# EAGLE design RedBoard (EAGLE 7.7.0)
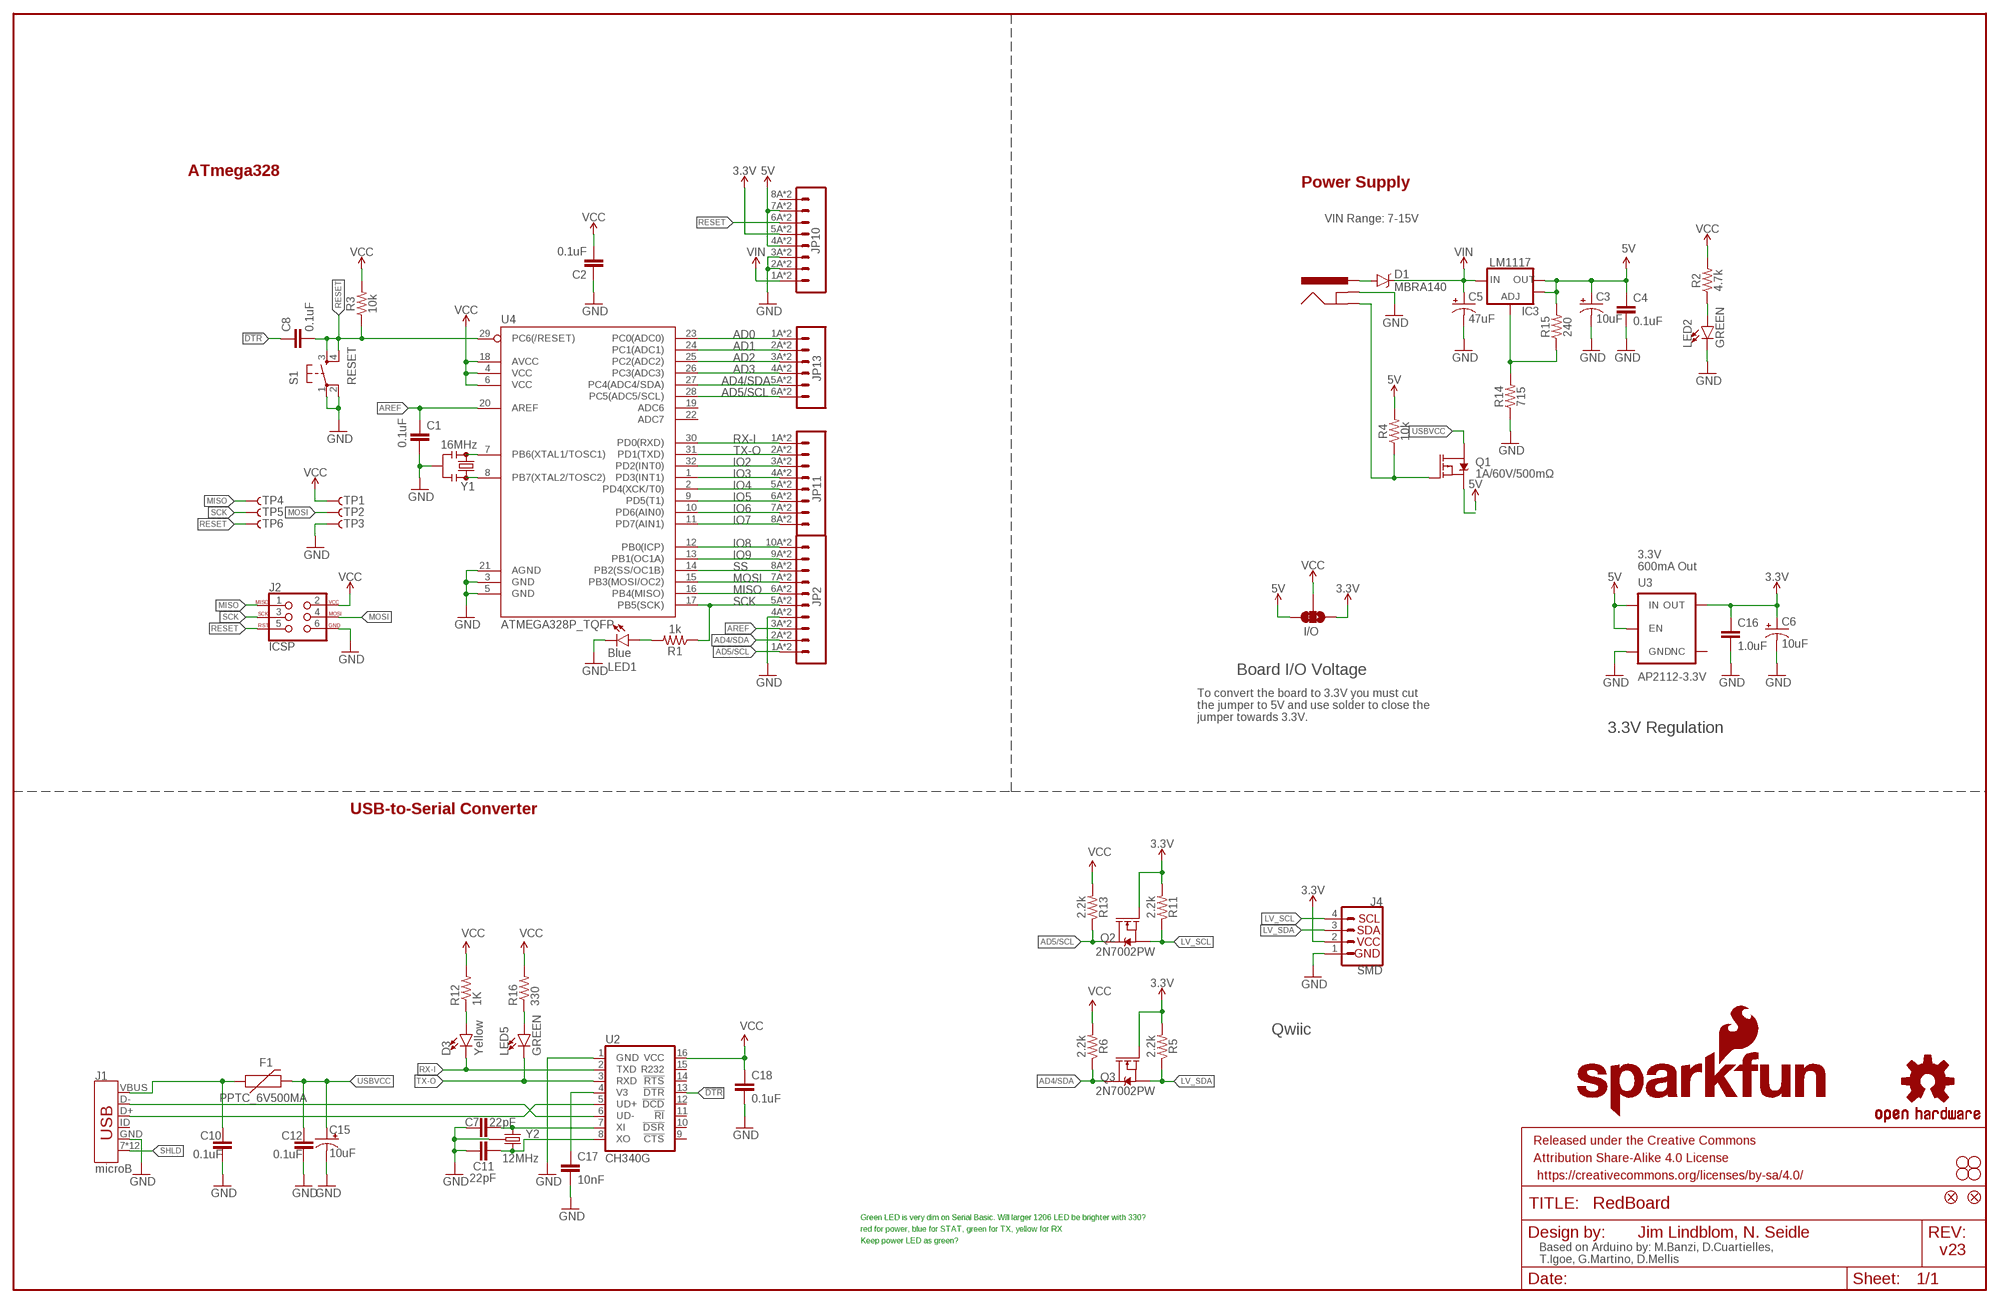
[diagram p0: schematic, sheet 1]

## Parts
C1  0.1uF  0.1UF-0603-25V-(+80/-20%)  [0603]
C2  0.1uF  0.1UF-0603-25V-(+80/-20%)  [0603]
C3  10uF  10UF-POLAR-EIA3216-16V-10%(TANT)  [EIA3216]
C4  0.1uF  0.1UF-0603-25V-(+80/-20%)  [0603]
C5  47uF  47UF-POLAR-PANASONIC_D-35V-20%  [PANASONIC_D]
C6  10uF  10UF-POLAR-EIA3216-16V-10%(TANT)  [EIA3216]
C7  22pF  22PF-0603-50V-5%  [0603]
C8  0.1uF  0.1UF-0603-25V-(+80/-20%)  [0603]
C10  0.1uF  0.1UF-0603-25V-(+80/-20%)  [0603]
C11  22pF  22PF-0603-50V-5%  [0603]
C12  0.1uF  0.1UF-0603-25V-(+80/-20%)  [0603]
C15  10uF  10UF-POLAR-EIA3216-16V-10%(TANT)  [EIA3216]
C16  1.0uF  1.0UF-16V-10%(0603)  [0603-CAP]
C17  10nF  10NF/10000PF-50V-10%(0603)  [0603-CAP]
C18  0.1uF  0.1UF-25V(+80/-20%)(0603)  [0603-CAP]
D1  MBRA140  [SMA-DIODE]
D3  Yellow  LED-YELLOW_HIDDENSILK  [LED-1206-HIDDENSILK]
F1  PPTC_6V500MA  [0805]
FRAME1  FRAME-LEDGER  [CREATIVE_COMMONS]
I/O  JUMPER-SMT_3_1-NC_TRACE_SILK  [SMT-JUMPER_3_1-NC_TRACE_SILK]
IC3  LM1117  V_REG_LM1117ALT1  [SOT223-ALT1]
J1  microB  USB_MICRO-B_HALF_PTH  [USB-MICROB-PTH]
J2  ICSP  AVR_SPI_PROG_3X2SMD  [2X3_SMT_POSTS]
J3  POWER_JACKSUPER_BOMB_DIGITY  [POWER_JACK_SMD_OVERPASTE_SUPER_BOMB_DIGITY]
J4  SMD  I2C_STANDARDJS-1MM  [1X04_1MM_RA]
JP1  SFE_LOGO_NAME.1_INCH  [SFE_LOGO_NAME_.1]
JP2  M10SMD_COMBO  [1X10_SMD_COMBINED]
JP3  STAND-OFF  [STAND-OFF]
JP4  STAND-OFF  [STAND-OFF]
JP5  STAND-OFF  [STAND-OFF]
JP6  STAND-OFF  [STAND-OFF]
JP7  SFE_LOGO_FLAME.1_INCH  [SFE_LOGO_FLAME_.1]
JP8  FIDUCIAL1X2  [FIDUCIAL-1X2]
JP9  FIDUCIAL1X2  [FIDUCIAL-1X2]
JP10  M08SMD-COMBO  [1X08_SMD_COMBINED]
JP11  JP11  M08SMD-COMBO  [1X08_SMD_COMBINED]
JP13  M06SMD-STRAIGHT-COMBO  [1X06_SMD_STRAIGHT_COMBO]
LED1  Blue  LED-BLUE_HIDDENSILK  [LED-1206-HIDDENSILK]
LED2  GREEN  LED-GREEN_HIDDENSILK  [LED-1206-HIDDENSILK]
LED5  GREEN  LED-GREEN_HIDDENSILK  [LED-1206-HIDDENSILK]
Q1  1A/60V/500mΩ  MOSFET-PCH-ZXMP6A13F  [SOT23-3]
Q2  2N7002PW  MOSFET-NCH-2N7002PW  [SOT323]
Q3  2N7002PW  MOSFET-NCH-2N7002PW  [SOT323]
R1  1k  1KOHM-0603-1/10W-1%  [0603]
R2  4.7k  4.7KOHM-0603-1/10W-1%  [0603]
R3  10k  10KOHM-0603-1/10W-1%  [0603]
R4  10k  10KOHM-0603-1/10W-1%  [0603]
R5  2.2k  2.2KOHM-0603-1/10W-1%  [0603]
R6  2.2k  2.2KOHM-0603-1/10W-1%  [0603]
R11  2.2k  2.2KOHM-0603-1/10W-1%  [0603]
R12  1K  1KOHM-1/10W-1%(0603)  [0603-RES]
R13  2.2k  2.2KOHM-0603-1/10W-1%  [0603]
R14  715  715OHM-0603-1/10W-1%  [0603]
R15  240  240OHM-0603-1/10W-1%  [0603]
R16  330  330OHM1/10W1%(0603)  [0603-RES]
S1  RESET  SWITCH_SPST_4_PINSQUARE  [TACTILE-SWITCH-SMD]
TP1  TP-3x5  TEST-POINT3X5  [PAD.03X.05]
TP2  TP-3x5  TEST-POINT3X5  [PAD.03X.05]
TP3  TP-3x5  TEST-POINT3X5  [PAD.03X.05]
TP4  TP-3x5  TEST-POINT3X5  [PAD.03X.05]
TP5  TP-3x5  TEST-POINT3X5  [PAD.03X.05]
TP6  TP-3x5  TEST-POINT3X5  [PAD.03X.05]
U2  CH340G  CH340GSMD  [SO016]
U3  AP2112-3.3V  V_REG_AP2112K-3.3V  [SOT23-5]
U4  ATMEGA328P_TQFP  [TQFP32-08]
U$16  OSHW-LOGOS  [OSHW-LOGO-S]
Y1  16MHz  RESONATOR-16MHZSMD_3.2X1.3  [RESONATOR-SMD-3.2X1.3]
Y2  12MHz  CRYSTAL-GROUNDED3.2X2.5  [CRYSTAL-SMD-3.2X2.5]

## Nets
3.3V: C6.+ C16.1 I/O.1 J4.2(VCC) JP10.5A JP10.5B Q2.1(G) Q3.1(G) R5.2 R11.2 U3.5(OUT)
5V: C3.+ C4.1 I/O.3 IC3.2(OUT) IC3.4(OUT) JP10.4A JP10.4B JP10.7A JP10.7B Q1.2(S) R4.2 R15.2 U3.1(IN) U3.3(EN)
!DTR: C8.1 U2.13(!DTR)
AD0: JP13.1A JP13.1B U4.23(PC0(ADC0))
AD1: JP13.2A JP13.2B U4.24(PC1(ADC1))
AD2: JP13.3A JP13.3B U4.25(PC2(ADC2))
AD3: JP13.4A JP13.4B U4.26(PC3(ADC3))
AD4/SDA: JP2.2A JP2.2B JP13.5A JP13.5B Q3.3(D) R6.1 U4.27(PC4(ADC4/SDA))
AD5/SCL: JP2.1A JP2.1B JP13.6A JP13.6B Q2.3(D) R13.1 U4.28(PC5(ADC5/SCL))
AREF: C1.1 JP2.3A JP2.3B U4.20(AREF)
GND: C1.2 C2.1 C3.- C4.2 C5.- C6.- C7.1 C10.2 C11.1 C12.2 C15.- C16.2 C17.2 C18.2 J1.GND J2.6 J3.GND(GNDBREAK) J4.1(GND) JP2.4A JP2.4B JP10.2A JP10.2B JP10.3A JP10.3B LED1.C LED2.C R14.1 S1.1 S1.2 TP3.P$1 U2.1(GND) U3.2(GND) U4.3(GND) U4.5(GND) U4.21(AGND) Y1.2 Y2.2(GND) Y2.4(GND)
INSERT: J3.P$4(GND) Q1.1(G) R4.1
IO2: JP11.3A JP11.3B U4.32(PD2(INT0))
IO3: JP11.4A JP11.4B U4.1(PD3(INT1))
IO4: JP11.5A JP11.5B U4.2(PD4(XCK/T0))
IO5: JP11.6A JP11.6B U4.9(PD5(T1))
IO6: JP11.7A JP11.7B U4.10(PD6(AIN0))
IO7: JP11.8A JP11.8B U4.11(PD7(AIN1))
IO8: JP2.10A JP2.10B U4.12(PB0(ICP))
IO9: JP2.9A JP2.9B U4.13(PB1(OC1A))
LV_SCL: J4.4(SCL) Q2.2(S) R11.1
LV_SDA: J4.3(SDA) Q3.2(S) R5.1
MISO: J2.1 JP2.6A JP2.6B TP4.P$1 U4.16(PB4(MISO))
MOSI: J2.4 JP2.7A JP2.7B TP2.P$1 U4.15(PB3(MOSI/OC2))
N$1: LED1.A R1.2
N$2: LED2.A R2.1
N$3: U4.7(PB6(XTAL1/TOSC1)) Y1.1
N$4: U4.8(PB7(XTAL2/TOSC2)) Y1.3
N$5: LED5.A R16.1
N$9: D3.A R12.1
N$11: C11.2 U2.8(XO) Y2.3
N$12: C7.2 U2.7(XI) Y2.1
N$13: J1.D- U2.6(UD-)
N$14: J1.D+ U2.5(UD+)
N$15: IC3.1(ADJ) R14.2 R15.1
PWRIN: D1.A J3.VIN0(PWR)
RESET: C8.2 J2.5 JP10.6A JP10.6B R3.1 S1.3 S1.4 TP6.P$1 U4.29(PC6(/RESET))
RX-I: D3.C JP11.1A JP11.1B U2.2(TXD) U4.30(PD0(RXD))
SCK: J2.3 JP2.5A JP2.5B R1.1 TP5.P$1 U4.17(PB5(SCK))
SHLD: J1.7(SHIELD) J1.SHEILD2(SHIELD) J1.SHIELD J1.SHIELD3(SHIELD) J1.SHIELD4(SHIELD) J1.SHIELD5(SHIELD) J1.SHIELD6(SHIELD) J1.SHIELD8(SHIELD) J1.SHIELD9(SHIELD) J1.SHIELD10(SHIELD) J1.SHIELD11(SHIELD) J1.SHIELD12(SHIELD)
SS: JP2.8A JP2.8B U4.14(PB2(SS/OC1B))
TX-O: JP11.2A JP11.2B LED5.C U2.3(RXD) U4.31(PD1(TXD))
USBVCC: C12.1 C15.+ F1.2 Q1.3(D)
V3: C17.1 U2.4(V3)
VCC: C2.2 C18.1 I/O.2 J2.2 R2.2 R3.2 R6.2 R12.2 R13.2 R16.2 TP1.P$1 U2.16(VCC) U4.4(VCC) U4.6(VCC) U4.18(AVCC)
VIN: C5.+ D1.C IC3.3(IN) JP10.1A JP10.1B
VUSB: C10.1 F1.1 J1.VBUS
Unconnected: J1.ID JP10.8A JP10.8B U2.9(!CTS) U2.10(!DSR) U2.11(!RI) U2.12(!DCD) U2.14(!RTS) U2.15(R232) U3.4(NC) U4.19(ADC6) U4.22(ADC7)

## Notes on the sheet
- ATmega328
- Power Supply
- VIN Range: 7-15V
- 3.3V
  600mA Out
- Board I/O Voltage
- To convert the board to 3.3V you must cut
  the jumper to 5V and use solder to close the
  jumper towards 3.3V.
- 3.3V Regulation
- USB-to-Serial Converter
- Qwiic
- Green LED is very dim on Serial Basic. Will larger 1206 LED be brighter with 330?
- red for power, blue for STAT, green for TX, yellow for RX
- Jim Lindblom, N. Seidle
- Keep power LED as green?
- v23
- Based on Arduino by: M.Banzi, D.Cuartielles, 
  T.Igoe, G.Martino, D.Mellis

## Library data of the parts
C1 C2 C4 C8 C10 C12 = SparkFun-Capacitors:0.1UF: 0.1µF ceramic capacitors A capacitor is a passive two-terminal electrical component used to store electrical energy temporarily in an electric field.; PROD_ID: CAP-00810
C3 C6 C15 = SparkFun-Capacitors:10UF-POLAR: 10.0µF polarized capacitors A capacitor is a passive two-terminal electrical component used to store electrical energy temporarily in an electric field.; PROD_ID: CAP-00811
C5 = SparkFun-Capacitors:47UF-POLAR: 47µF polarized capacitors A capacitor is a passive two-terminal electrical component used to store electrical energy temporarily in an electric field.; PROD_ID: CAP-08478
C7 C11 = SparkFun-Capacitors:22PF: 22pF ceramic capacitors A capacitor is a passive two-terminal electrical component used to store electrical energy temporarily in an electric field.; PROD_ID: CAP-07876
C16 = SparkFun-Capacitors:1.0UF-16V-10%(0603): CAP-00868; PROD_ID: CAP-00868
C17 = SparkFun-Capacitors:10NF/10000PF-50V-10%(0603): CAP-00867; PROD_ID: CAP-00867
C18 = SparkFun-Capacitors:0.1UF-25V(+80/-20%)(0603): CAP-00810 Ceramic Standard decoupling cap; PROD_ID: CAP-00810
D1 = SparkFun-DiscreteSemi:MBRA140: 40V, 1A Schottky rectifier SMA/DO-214AC package DIO-08053; PROD_ID: DIO-08053
D3 = SparkFun-LED:LED-YELLOW: Yellow SMD LED Used in manufacturing several products at SparkFun. Packages: 0603 - SMD 0603 package[Product Link] <http://www.kingbrightusa.com/product.asp?catalog_name=LED&product_id=APT1608SYCK> 0603 -SMART - SMART SMD 0603 package (more efficient/more expensive) [Product Link] <http://www.osram-os.com/osram_os/en/products/product-catalog/led-light-emitting-diodes/smartled-0603/ly-l29k/index.jsp> LilyPad - SMD1206 package[Product Datasheet] <https://www.sparkfun.com/datasheets/DevTools/LilyPad/Q150YUS4.pdf> SparkFun Products: Blynk Board <https://www.sparkfun.com/products/13794> IOIO-OTG <https://www.sparkfun.com/products/13613> XBee Explorer Serial <https://www.sparkfun.com/products/13225>; PROD_ID: DIO-09909
F1 = SparkFun-Fuses:PPTC: Resettable Fuse PPTC Resettable Fuse. Really a sort of resistor with a polymeric positive temperature coefficient whose resistance increases dramatically with an increase in temperature. When heated by the power passing through the resistance rises causing the current to be limited, protecting the circuit. This is achieved by the transition of the polymer from a crystalline to an amorphous state where the conductive carbon separates breaking the conductive pathways found in the cool crystalline structure. When a PPTC cools back down it resumes conducting letting the circuit turn back on. SparkFun Products: SparkFun RedBoard - Programmed with Arduino <https://www.sparkfun.com/products/12757> Pro Micro - 5V/16MHz <https://www.sparkfun.com/products/12640> Arduino Pro 328 - 5V/16MHz <https://www.sparkfun.com/products/10915> MP3 Trigger <https://www.sparkfun.com/products/13720>
FRAME1 = SparkFun-Aesthetics:FRAME-LEDGER: Schematic Frame - Ledger Standard 11x14 US Ledger frame
I/O = SparkFun-Jumpers:JUMPER-SMT_3_1-NC_TRACE: Normally closed trace jumper (1 of 2 connections) This jumper has a trace between two pads so it's normally closed (NC). The other connection is normally open (NO). Use a razor knife to open the connection. For best results follow the IPC guidelines for cutting traces: Cutout at least 0.063 mm (0.005 in). Remove all loose material to clean up the cut area. Seal the cut with an approved epoxy. Reapply solder to reclose the connection, or to close the NO connection.
IC3 = Testing:V_REG_LM1117: Voltage Regulator LM1117 Standard adjustable voltage regulator but in SMD form. Spark Fun Electronics SKU : COM-00595; PROD_ID: VREG-08170
J1 = SparkFun-Connectors:USB_MICRO-B: USB Type Micro-B Connector Male/female and PTH/SMT variants SparkFun Products: SparkFun microB USB Breakout <https://www.sparkfun.com/products/12035> SparkFun USB microB Plug Breakout <https://www.sparkfun.com/products/10031> SparkFun ESP8266 Thing <https://www.sparkfun.com/products/13231>; PROD_ID: CONN-13711; VALUE: AMP FCI 10103594-0001LF
J2 = SparkFun-Connectors:AVR_SPI_PROG_3X2: AVR ISP 6 Pin This is the reduced ISP connector for AVR programming. Common on Arduino. This footprint will take up less PCB space and can be used with a 10-pin to 6-pin adapter such as SKU: BOB-08508 **Special note about "TEST_POINT" package. The stop mask is on the top side, so if you want your programming test points to be on the bottom of your board, make sure to place this package on the bottom side of the board. This also ensure that the orientation to program from the bottom side will be correct.; PROD_ID: CONN-11415
J3 = Testing:POWER_JACK: Power Jack This is the standard 5.5mm barrel jack for power. The PTH is the most common, proven, reliable, footprint. All others are experimental. The Slot footprint only works if the mill layer is transmitted to the PCB fab house so be warned. Spark Fun Electronics SKU : PRT-00119. Mating wall wart : TOL-00298 (and others); PROD_ID: CONN-08106
J4 = SparkX:I2C_STANDARD: SparkFun I2C Standard Pinout Header SparkFun has standardized on a pinout for all I2C based sensor breakouts. This pinout allows I2C boards to be plugged directly into the headers on Arduino Uno compatible boards, and to be daisy chained easily. Example SparkFun Products: SparkFun Atmospheric Sensor Breakout - BME280 <https://www.sparkfun.com/products/13676> SparkFun Altitude/Pressure Sensor Breakout - MPL3115A2 <https://www.sparkfun.com/products/11084> SparkFun TOF Range Finder Sensor - VL6180 <https://www.sparkfun.com/products/12785>
JP1 = SparkFun-Aesthetics:SFE_LOGO_NAME: SFE Logo, name only This is the SparkFun name logo. The logo on the schematic will always be the same size; the package variant is the height of the flame part of the logo (or the height the flame would be, if it were drawn). Default layer for the logo on the board is tSilk.
JP2 = SparkFun-Connectors:M10: Header 10 Standard 10-pin 0.1" header. Use with straight break away headers (SKU : PRT-00116), right angle break away headers (PRT-00553), swiss pins (PRT-00743), machine pins (PRT-00117), and female headers (PRT-00115).; PROD_ID: CONN-11219
JP3-JP6 = SparkFun:STAND-OFF: Stand Off This is the mechanical footprint for a #4 phillips button head screw. Use the keepout ring to avoid running the screw head into surrounding components. SKU : PRT-00447
JP7 = SparkFun-Aesthetics:SFE_LOGO_FLAME: SFE Logo, flame only This is the SparkFun flame logo. The logo on the schematic will always be the same size; the package variant is the height of the flame. Default layer for the logo on the board is tSilk.
JP8 JP9 = SparkFun:FIDUCIAL: Fiducial Alignment Points Various fiducial points for machine vision alignment.
JP10 JP11 = SparkFun-Connectors:M08: Header 8 Standard 8-pin 0.1" header. Use with straight break away headers (SKU : PRT-00116), right angle break away headers (PRT-00553), swiss pins (PRT-00743), machine pins (PRT-00117), and female headers (PRT-00115).; PROD_ID: CONN-10204
JP13 = SparkFun-Connectors:M06: Header 6 Standard 6-pin 0.1" header. Use with straight break away headers (SKU : PRT-00116), right angle break away headers (PRT-00553), swiss pins (PRT-00743), machine pins (PRT-00117), and female headers (PRT-00115). Molex polarized connector foot print use with SKU : PRT-08094 with associated crimp pins and housings. NOTES ON THE VARIANTS LOCK and LOCK_LONGPADS... This footprint was designed to help hold the alignment of a through-hole component (i.e. 6-pin header) while soldering it into place. You may notice that each hole has been shifted either up or down by 0.005 of an inch from it's more standard position (which is a perfectly straight line). This slight alteration caused the pins (the squares in the middle) to touch the edges of the holes. Because they are alternating, it causes a "brace" to hold the component in place. 0.005 has proven to be the perfect amount of "off-center" position when using our standard breakaway headers. Although looks a little odd when you look at the bare footprint, once you have a header in there, the alteration is very hard to notice. Also,if you push a header all the way into place, it is covered up entirely on the bottom side. This idea of altering the position of holes to aid alignment will be further integrated into the Sparkfun Library for other footprints. It can help hold any component with 3 or more connection pins.; PROD_ID: CONN-10203
LED1 = SparkFun-LED:LED-BLUE: Blue SMD LED Used in manufacturing of various products at SparkFun Packages: 0603 - SMD 0603 package [Product Link] <http://www.digikey.com/product-detail/en/SMLE12BC7TT86/511-1589-2-ND/1641808> 1206 - SMD1206 package [Product Link] <http://www.digikey.com/product-detail/en/lite-on-inc/LTST-C150TBKT/160-1643-1-ND/573584> SparkFun Products: ESP8266 Thing-Dev Board <https://www.sparkfun.com/products/13711> RedBoard <https://www.sparkfun.com/products/12757>; PROD_ID: DIO-09911
LED2 = SparkFun-LED:LED-GREEN: Green SMD LED Used in manufacturing of various products at SparkFun Packages: 0603 - SMD 0603 package [Product Link] <http://www.futureelectronics.com/en/technologies/semiconductors/optoelectronics/leds/Pages/9894312-LTST-C190GKT.aspx?CrossPart=HSMG-C190&IM=0> LilyPad 1206 - SMD1206 LilyPad package [Product Link] <http://www.futureelectronics.com/en/Technologies/Product.aspx?ProductID=IN150NGHARVATEKCORPORATION2049943&IM=0> 1206 - SMD1206 package [Product Link] <http://www.futureelectronics.com/en/technologies/semiconductors/optoelectronics/leds/Pages/8315665-LTST-C150KGKT.aspx?IM=0> 1206 Bottom Mount -SMD 1206 Bottom Mount [Product Link] <http://www.digikey.com/product-detail/en/lite-on-inc/LTST-C230KGKT/160-1456-1-ND/386854> SparkFun Products: Pro Mini 328 -5V <https://www.sparkfun.com/products/821> RedBoard <https://www.sparkfun.com/products/12757> MP3 Trigger <https://www.sparkfun.com/products/13720> Makey Makey <https://www.sparkfun.com/products/11076>; PROD_ID: DIO-09910
LED5 = SparkFun-LED:LED-GREEN: Green SMD LED Used in manufacturing of various products at SparkFun Packages: 0603 - SMD 0603 package [Product Link] <http://www.futureelectronics.com/en/technologies/semiconductors/optoelectronics/leds/Pages/9894312-LTST-C190GKT.aspx?CrossPart=HSMG-C190&IM=0> LilyPad 1206 - SMD1206 LilyPad package [Product Link] <http://www.futureelectronics.com/en/Technologies/Product.aspx?ProductID=IN150NGHARVATEKCORPORATION2049943&IM=0> 1206 - SMD1206 package [Product Link] <http://www.futureelectronics.com/en/technologies/semiconductors/optoelectronics/leds/Pages/8315665-LTST-C150KGKT.aspx?IM=0> 1206 Bottom Mount -SMD 1206 Bottom Mount [Product Link] <http://www.digikey.com/product-detail/en/lite-on-inc/LTST-C230KGKT/160-1456-1-ND/386854> SparkFun Products: Pro Mini 328 -5V <https://www.sparkfun.com/products/821> RedBoard <https://www.sparkfun.com/products/12757> MP3 Trigger <https://www.sparkfun.com/products/13720> Makey Makey <https://www.sparkfun.com/products/11076>; PROD_ID: DIO-00862
Q1 = SparkFun-DiscreteSemi:MOSFET-PCH: P-channel MOSFETs Voltage controlled devices that allow control of high current outputs.; PROD_ID: TRANS-08285
Q2 Q3 = SparkFun-DiscreteSemi:MOSFET-NCH: N-channel MOSFETs Voltage controlled devices that allow control of high current outputs.; PROD_ID: TRANS-11151; VALUE: 310mA/60V/1.6Ω
R1 = SparkFun-Resistors:1KOHM: 1kΩ resistor A resistor is a passive two-terminal electrical component that implements electrical resistance as a circuit element. Resistors act to reduce current flow, and, at the same time, act to lower voltage levels within circuits.; PROD_ID: RES-07856
R2 = SparkFun-Resistors:4.7KOHM: 4.7kΩ resistor A resistor is a passive two-terminal electrical component that implements electrical resistance as a circuit element. Resistors act to reduce current flow, and, at the same time, act to lower voltage levels within circuits.; PROD_ID: RES-07857
R3 R4 = SparkFun-Resistors:10KOHM: 10kΩ resistor A resistor is a passive two-terminal electrical component that implements electrical resistance as a circuit element. Resistors act to reduce current flow, and, at the same time, act to lower voltage levels within circuits.; PROD_ID: RES-00824
R5 R6 R11 R13 = SparkFun-Resistors:2.2KOHM: 2.2kΩ resistor A resistor is a passive two-terminal electrical component that implements electrical resistance as a circuit element. Resistors act to reduce current flow, and, at the same time, act to lower voltage levels within circuits. - Wikipedia; PROD_ID: RES-08272
R12 = SparkFun-Resistors:1KOHM-1/10W-1%(0603): RES-07856; PROD_ID: RES-07856
R14 = SparkFun-Resistors:715OHM: 715Ω resistor A resistor is a passive two-terminal electrical component that implements electrical resistance as a circuit element. Resistors act to reduce current flow, and, at the same time, act to lower voltage levels within circuits.; PROD_ID: RES-07850
R15 = SparkFun-Resistors:240OHM: 240Ω resistor A resistor is a passive two-terminal electrical component that implements electrical resistance as a circuit element. Resistors act to reduce current flow, and, at the same time, act to lower voltage levels within circuits.; PROD_ID: RES-07849
R16 = SparkFun-Resistors:330OHM1/10W1%(0603): RES-00818; PROD_ID: RES-00818
S1 = SparkFun-Electromechanical:SWITCH_SPST_4_PIN; PROD_ID: SWCH-08247
TP1-TP4 TP6 = SparkFun-Connectors:TEST-POINT: Bare copper test points for troubleshooting or ICT
TP5 = SparkFun-Passives:TEST-POINT: Bare copper test points for troubleshooting or ICT
U2 = SparkFun-DigitalIC:CH340G: A simple USB 2.0 to Serial IC.; PROD_ID: IC-13498
U3 = SparkFun-PowerIC:V_REG_AP2112: AP2112 - 600mA CMOS LDO Regulator w/ Enable The AP2112 is CMOS process low dropout linear regulator with enable function, the regulator delivers a guaranteed 600mA (min.) continuous load current. Features Output Voltage Accuracy: ±1.5% Output Current: 600mA (Min.) Foldback Short Current Protection: 50mA Enable Function to Turn ON/OFF VOUT Low Dropout Voltage (3.3V): 250mV (Typ.) @IOUT=600mA Excellent Load Regulation: 0.2%/A (Typ.) Excellent Line Regulation: 0.02%/V (Typ.) Low Quiescent Current: 55μA (Typ.) Low Standby Current: 0.01μA (Typ.) Low Output Noise: 50μVRMS PSRR: 100Hz -65dB, 1kHz -65dB OTSD Protection Stable with 1.0μF Flexible Cap: Ceramic, Tantalum and Aluminum Electrolytic Operation Temperature Range: -40°C to 85°C ESD: MM 400V, HBM 4000V; PROD_ID: VREG-12457; VALUE: 3.3V
U4 = SparkFun-IC-Microcontroller:ATMEGA328P_TQFP; PROD_ID: IC-09069
U$16 = SparkFun-Aesthetics:OSHW-LOGO: Open Source Hardware Logo This logo indicates the piece of hardware it is found on incorporates a OSHW license and/or adheres to the definition of open source hardware found here: http://freedomdefined.org/OSHW
Y1 = SparkFun-Clocks:RESONATOR-16MHZ: 16MHz Resonator Digikey Example <http://www.digikey.com/product-detail/en/murata-electronics-north-america/CSTCE16M0V53-R0/490-1198-1-ND/584635> Frequency: 16MHz Frequency Stability: ±0.3% Frequency Tolerance: ±0.5% Capacitance: 15pF; PROD_ID: XTAL-08900
Y2 = USB Basic:CRYSTAL-GROUNDED: Small, 3.2x2.5mm, SMD Crystal; PROD_ID: XTAL-13518

## Net classes
1 power: width 0.178 mm

## Board
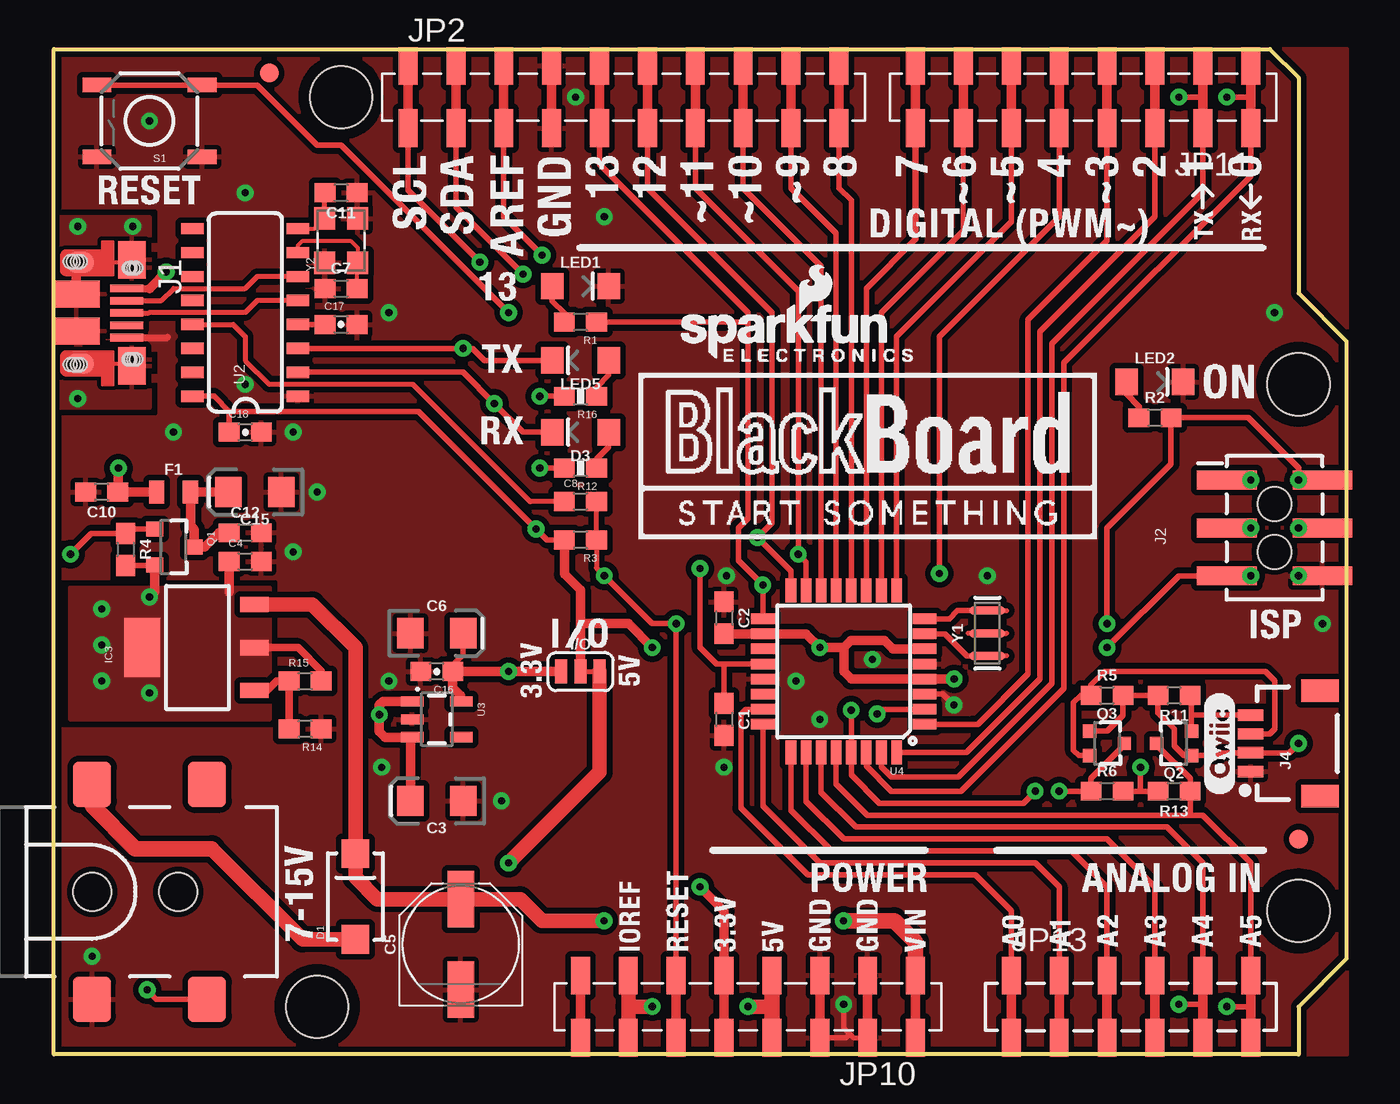
[diagram p1: board, top side]
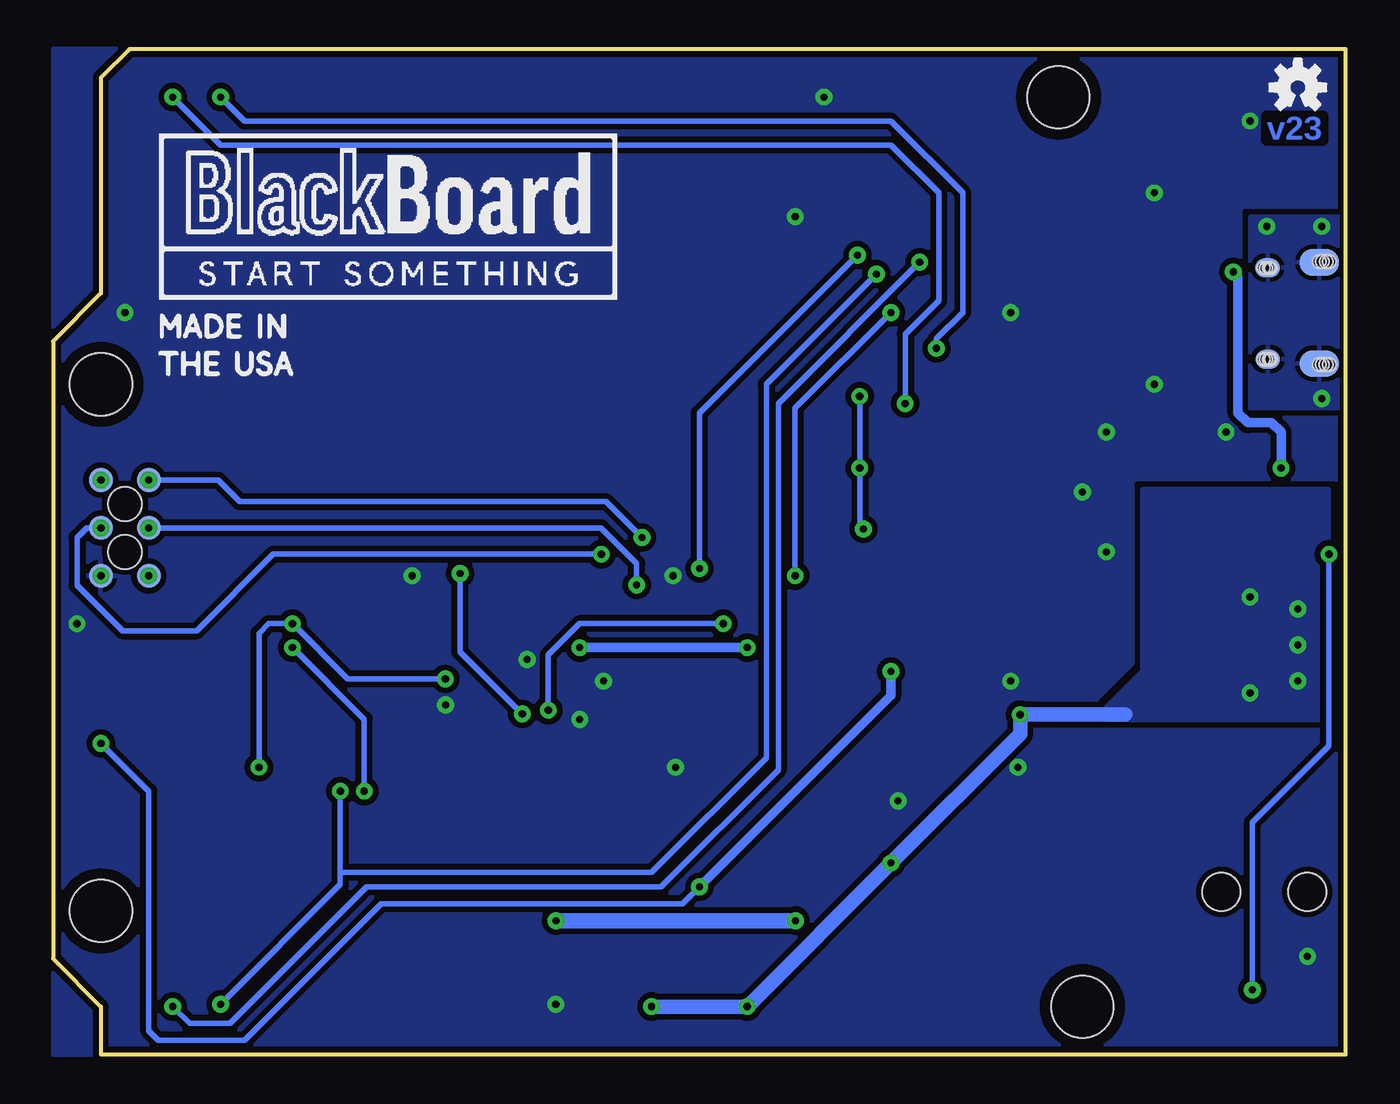
[diagram p2: board, bottom side, seen from below]

Size 68.58 x 53.34 mm. Coordinates in mm from the lower left corner, seen from the top.
Outline: 0,53.34 64.52,53.34 66.04,51.82 66.04,40.39 68.58,37.85 68.58,5.08 66.04,2.54 66.04,0 0,0 0,53.34
Copper layers (1*16): Top 0.035mm / dielectric 1.5mm / Bottom 0.035mm
Design rules "SparkFun-2-layer": minimum track width 7mil, minimum drill 15mil, track to track 8mil, track to pad 8mil, pad to pad 8mil, via to via 8mil, smd to smd 8mil, copper to edge 8mil, drill to drill 8mil, minimum pad ring 12mil, minimum via ring 10mil, stop-mask expansion 4mil, vias tented up to drill 20mil, thermal gap 10mil
vRestrict: area 0.6,22.4 to 2,30.6; area 5.7,23.1 to 7.4,30.6; area 47.9,10.8 to 48.5,11.3; area 50.4,10.7 to 50.9,11.6; area 11.3,29.3 to 12.7,31.6; area 0.3,13 to 9.4,25

### Footprints (pad centres in the part's own frame; a part is rotated, then mirrored left to right if it is on the bottom)
0603 = smd 1.1 x 1: 1 -0.85,0; 2 0.85,0
EIA3216 = smd 1.4 x 1.6: + 1.4,0; - -1.4,0
PANASONIC_D = smd 3 x 1.4: + 2.4,0; - -2.4,0
0603-CAP = smd 1.1 x 1: 1 -0.85,0; 2 0.85,0
SMA-DIODE = smd 1.524 x 1.47: A -2.277,0; C 2.277,0
LED-1206-HIDDENSILK = smd 1.2 x 1.4: A -1.5,0; C 1.5,0
0805 = smd 0.8 x 1.2: 1 -0.9,0; 2 0.9,0
SMT-JUMPER_3_1-NC_TRACE_SILK = smd 0.635 x 1.27: 1 -1.016,0; 2 0,0; 3 1.016,0
SOT223-ALT1 = smd 0.813 x 1.524: 1 -2.271,-3.02; 2 0,-3.02; 3 2.288,-3.02 | smd 3.124 x 1.905: 4 0,2.921
USB-MICROB-PTH = smd 1.4 x 2.1 bottom: 7 2.701,-1.142; SHIELD5 -2.659,-1.144 | smd 0.4 x 1.75: D+ 0.031,1.331; D- -0.619,1.331; GND 1.331,1.331; ID 0.681,1.331; VBUS -1.269,1.331 | smd 2 x 1.46: SHEILD2 2.831,1.606; SHIELD -2.794,1.606 | smd 1.425 x 2.5: SHIELD3 -0.979,-1.349; SHIELD4 0.996,-1.352 | smd 1.1 x 1.5: SHIELD6 2.701,-1.142; SHIELD8 -2.659,-1.144 | smd 1 x 1.3 bottom: SHIELD9 -2.368,1.604; SHIELD12 2.481,1.598 | smd 1 x 1.3: SHIELD10 -2.368,1.604; SHIELD11 2.487,1.594 | hole 0.7: -2.693,-1.134; -2.693,-1.3; -2.694,-1.499; -2.694,-1.664; 2.768,-1.134; 2.767,-1.303; 2.766,-1.496; 2.766,-1.664 | hole 0.66: -2.359,1.821; -2.349,1.691; -2.359,1.541; -2.354,1.432; 2.481,1.821; 2.491,1.691; 2.481,1.541; 2.486,1.432
2X3_SMT_POSTS = smd 1 x 3.17: 1 -2.54,-2.54; 2 -2.54,2.54; 3 0,-2.54; 4 0,2.54; 5 2.54,-2.54; 6 2.54,2.54 | hole 1.8: -1.27,0; 1.27,0
POWER_JACK_SMD_OVERPASTE_SUPER_BOMB_DIGITY = smd 2 x 2.4: GND 0,-5.7; P$4 6.1,-5.7; VIN0 0,5.7; VIN1 6.1,5.7 | hole 2.032: 0,0; 4.572,0
1X04_1MM_RA = smd 0.6 x 1.35: 1 -1.5,0; 2 -0.5,0; 3 0.5,0; 4 1.5,0 | smd 1.2 x 2: NC1 2.8,-3.675; NC2 -2.8,-3.675
1X10_SMD_COMBINED = smd 1 x 2: 1A 0,1.65; 1B 0,-1.65; 2A 2.54,1.65; 2B 2.54,-1.65; 3A 5.08,1.65; 3B 5.08,-1.65; 4A 7.62,1.65; 4B 7.62,-1.65; 5A 10.16,1.65; 5B 10.16,-1.65; 6A 12.7,1.65; 6B 12.7,-1.65; 7A 15.24,1.65; 7B 15.24,-1.65; 8A 17.78,1.65; 8B 17.78,-1.65; 9A 20.32,1.65; 9B 20.32,-1.65; 10A 22.86,1.65; 10B 22.86,-1.65
STAND-OFF = hole 3.302: 0,0
FIDUCIAL-1X2 = smd 1 x 1: 1 0,0
1X08_SMD_COMBINED = smd 1 x 2: 1A 0,1.65; 1B 0,-1.65; 2A 2.54,-1.65; 2B 2.54,1.65; 3A 5.08,1.65; 3B 5.08,-1.65; 4A 7.62,-1.65; 4B 7.62,1.65; 5A 10.16,1.65; 5B 10.16,-1.65; 6A 12.7,-1.65; 6B 12.7,1.65; 7A 15.24,1.65; 7B 15.24,-1.65; 8A 17.78,-1.65; 8B 17.78,1.65
1X06_SMD_STRAIGHT_COMBO = smd 1 x 2: 1A 0,-1.65; 1B 0,1.65; 2A 2.54,1.65; 2B 2.54,-1.65; 3A 5.08,-1.65; 3B 5.08,1.65; 4A 7.62,1.65; 4B 7.62,-1.65; 5A 10.16,-1.65; 5B 10.16,1.65; 6A 12.7,1.65; 6B 12.7,-1.65
SOT23-3 = smd 0.8 x 0.9: 1 -0.95,-1; 2 0.95,-1; 3 0,1.1
SOT323 = smd 0.7 x 0.7: 1 -0.65,-0.925; 2 0.65,-0.925; 3 0,0.925
0603-RES = smd 1.1 x 1: 1 -0.85,0; 2 0.85,0
TACTILE-SWITCH-SMD = smd 1.524 x 0.762: 1 -2.794,1.905; 2 2.794,1.905; 3 -2.794,-1.905; 4 2.794,-1.905
PAD.03X.05 = smd 1.27 x 1.27: P$1 0,0
SO016 = smd 0.6 x 1.2: 1 -4.445,-2.8; 2 -3.175,-2.8; 3 -1.905,-2.8; 4 -0.635,-2.8; 5 0.635,-2.8; 6 1.905,-2.8; 7 3.175,-2.8; 8 4.445,-2.8; 9 4.445,2.8; 10 3.175,2.8; 11 1.905,2.8; 12 0.635,2.8; 13 -0.635,2.8; 14 -1.905,2.8; 15 -3.175,2.8; 16 -4.445,2.8
SOT23-5 = smd 0.55 x 1.2: 1 -0.95,-1.3; 2 0,-1.3; 3 0.95,-1.3; 4 0.95,1.3; 5 -0.95,1.3
TQFP32-08 = smd 1.27 x 0.559: 1 -4.293,2.8; 2 -4.293,2; 3 -4.293,1.2; 4 -4.293,0.4; 5 -4.293,-0.4; 6 -4.293,-1.2; 7 -4.293,-2; 8 -4.293,-2.8; 17 4.293,-2.8; 18 4.293,-2; 19 4.293,-1.2; 20 4.293,-0.4; 21 4.293,0.4; 22 4.293,1.2; 23 4.293,2; 24 4.293,2.8 | smd 0.559 x 1.27: 9 -2.8,-4.293; 10 -2,-4.293; 11 -1.2,-4.293; 12 -0.4,-4.293; 13 0.4,-4.293; 14 1.2,-4.293; 15 2,-4.293; 16 2.8,-4.293; 25 2.8,4.293; 26 2,4.293; 27 1.2,4.293; 28 0.4,4.293; 29 -0.4,4.293; 30 -1.2,4.293; 31 -2,4.293; 32 -2.8,4.293
RESONATOR-SMD-3.2X1.3 = smd 0.45 x 1.905: 1 -1.2,0; 2 0,0; 3 1.2,0
CRYSTAL-SMD-3.2X2.5 = smd 1.2 x 1.1: 1 -1.175,-0.875; 2 1.175,-0.875; 3 1.175,0.875; 4 -1.175,0.875

### Placement (x,y rotation side)
C1  35.56,17.78 270 top
C2  35.56,23.17 270 top
C3  20.32,13.46 180 top
C4  10.16,26.16 0 top
C5  21.59,5.84 90 top
C6  20.32,22.35 0 top
C7  15.24,40.64 0 top
C8  27.94,29.34 0 top
C10  2.54,29.84 180 top
C11  15.24,45.72 180 top
C12  10.16,27.69 0 top
C15  10.67,29.84 180 top
C16  20.32,20.32 180 top
C17  15.24,38.73 0 top
C18  10.16,33.02 0 top
D1  16,8.38 90 top
D3  27.94,33.02 180 top
F1  6.35,29.84 0 top
FRAME1  -1.27,-35.56 0 top  (outside the outline)
I/O  27.94,20.32 0 top
IC3  7.62,21.59 90 top
J1  2.54,39.37 270 top
J2  64.77,27.94 270 top
J3  2.03,8.64 0 top
J4  63.5,16.51 90 top
JP1  32.79,36.45 0 top
JP2  18.8,50.8 0 top
JP3  13.97,2.54 0 top
JP4  66.04,7.62 0 top
JP5  66.04,35.56 0 top
JP6  15.24,50.8 0 top
JP7  39.27,38.99 0 top
JP8  66.04,11.43 0 top
JP9  11.43,52.07 0 top
JP10  45.72,2.54 180 top
JP11  63.5,50.8 180 top
JP13  50.8,2.54 0 top
LED1  27.94,40.77 0 top
LED2  58.42,35.69 0 top
LED5  27.94,36.83 180 top
Q1  6.35,26.92 270 top
Q2  59.44,16.51 90 top
Q3  55.88,16.51 270 top
R1  27.94,38.86 180 top
R2  58.42,33.78 0 top
R3  27.94,27.3 180 top
R4  3.81,26.8 270 top
R5  55.88,19.05 0 top
R6  55.88,13.97 0 top
R11  59.44,19.05 180 top
R12  27.94,31.11 180 top
R13  59.44,13.97 180 top
R14  13.34,17.27 180 top
R15  13.34,19.81 0 top
R16  27.94,34.92 180 top
S1  5.08,49.53 180 top
TP1  66.04,30.48 0 bottom
TP2  66.04,27.94 0 bottom
TP3  66.04,25.4 0 bottom
TP4  63.5,30.48 0 bottom
TP5  63.5,27.94 0 bottom
TP6  63.5,25.4 0 bottom
U2  10.16,39.37 90 top
U3  20.32,17.78 270 top
U4  41.91,20.32 180 top
U$1  [BLACKBOARDLOGO#PNG]  43.18,31.75 0 top
U$2  [(QWIIC)]  61.85,13.72 90 top
U$3  [BLACKBOARDLOGO#PNG]  50.8,44.45 0 bottom
U$4  [MADEINUSA#PNG]  59.44,37.59 0 bottom
U$16  2.54,51.31 0 bottom
Y1  49.53,22.35 90 top
Y2  15.24,43.18 90 top

### Tracks (layer width: path | path; a pad name or v marks a point on that pad's centre or on a via)
3.3V  (via drill 0.38)
  Top 0.305: C6.+ 21.72,21.21 21.17,20.66 C16.1 | Q3.1 55.9,17.16 56.73,18 R5.2 R11.2 58.59,18.12 59.44,17.27 59.44,16.38 59.96,15.86 Q2.1 61.83,15.86 61.98,16.01 J4.2 65.54,16.01 v66.04,16.51
  Top 0.508: JP10.5A 35.56,7.62 v34.29,8.89 | I/O.1 v24.13,20.32 C16.1 21.17,19.47 21.59,19.05 21.59,18.76 U3.5
  Bottom 0.305: v34.29,8.89 35.18,8 51.18,8 58.42,0.76 62.99,0.76 63.5,1.27 63.5,13.97 v66.04,16.51
  Bottom 0.508: v24.13,20.32 24.13,19.05 v34.29,8.89
5V  (via drill 0.38)
  Top 0.305: JP10.4A 38.1,2.03 | R4.2 5.32,25.95 Q1.2
  Top 0.406: IC3.2 12.95,21.59 14.19,20.36 R15.2 | C3.+ 19.05,13.46
  Top 0.508: C3.+ 18.92,16.73 U3.3 17.59,16.83 17.27,17.14 v17.27,18.03 17.27,18.54 17.46,18.73 U3.1 | Q1.2 5.35,24.54 v5.08,24.27 | C4.1 9.31,24.55
  Top 0.762: v36.83,2.54 37.85,2.54 38.1,2.79 | v31.75,2.54 30.48,2.54 | 30.48,2.54 JP10.7A | JP10.7B 30.48,2.54 | I/O.3 28.96,14.99 v24.13,10.16
  Top 0.813: JP10.4A 38.1,2.79 38.1,2.03 JP10.4B
  Bottom 0.762: v36.83,2.54 v31.75,2.54 v24.13,10.16 17.27,17.02 v17.27,18.03 | v17.27,18.03 11.68,18.03 | 16.51,18.03 v17.27,18.03
  other vias: 2.54,21.73 5.08,19.19 2.54,19.82 2.54,23.63
  pour Bottom (isolate 0.305, no thermals): 0.89,29.97 10.79,29.97 10.79,20.32 12.7,18.41 12.7,17.78 0.89,17.78
  pour Top (isolate 0.305, no thermals): 0.89,17.78 0.89,24.77 11.43,24.77 11.43,17.78
!DTR
  Top 0.254: U2.13 9.53,38.73 10.16,38.1 10.16,36.83 11.43,35.56 19.05,35.56 25.27,29.34 C8.1
AD0
  Top 0.305: JP13.1A 50.8,7.62 48.9,9.53 40.01,9.53 36.45,13.08 36.45,18.03 36.73,18.32 U4.23
AD1
  Top 0.305: U4.24 37.62,13.18 40.64,10.16 52.07,10.16 53.34,8.89 JP13.2A
AD2
  Top 0.305: U4.25 39.11,12.96 41.27,10.79 53.98,10.79 55.88,8.89 JP13.3A
AD3
  Top 0.305: U4.26 39.91,13.43 41.91,11.43 55.88,11.43 58.42,8.89 JP13.4A
AD4/SDA  (via drill 0.38)
  Top 0.305: U4.27 40.71,13.9 42.55,12.06 59.05,12.06 60.96,10.16 60.96,2.67 | 60.96,2.67 JP13.5A | JP2.2B 21.34,44.96 v24.89,41.4 | v59.69,2.67 60.96,2.67 | Q3.3 56.8,16.42 55.03,14.64 R6.1 v53.34,13.97
  Bottom 0.305: 53.34,9.65 36.83,9.65 30.73,15.75 30.73,35.56 v24.89,41.4 | v59.69,2.67 53.34,9.02 53.34,9.65 | v53.34,13.97 53.34,9.65
AD5/SCL  (via drill 0.38)
  Top 0.305: U4.28 41.51,14.37 43.18,12.7 60.2,12.7 | 60.2,12.7 60.96,12.7 63.5,10.16 JP13.6A 63.5,2.54 v62.23,2.54 | JP2.1B 18.8,45.85 v22.61,42.04 | Q2.3 58.59,16.43 58.59,16.34 60.29,14.64 R13.1 60.29,12.79 60.2,12.7
  Bottom 0.305: v22.61,42.04 30.1,34.54 30.1,15.11 36.32,8.89 51.94,8.89 59.18,1.65 61.34,1.65 v62.23,2.54
AREF  (via drill 0.38)
  Top 0.305: 35.56,20.72 35.16,20.72 34.29,21.59 v34.29,25.78 | 35.56,20.72 U4.20 | C1.1 35.56,20.72 | JP2.3B 23.88,44.45 v25.91,42.42
  Bottom 0.305: v25.91,42.42 34.29,34.04 v34.29,25.78
GND  (via drill 0.38, 0.38 pad 0.51)
  Top 0.254: JP10.2B 42.42,0.89 42.23,1.08 41.91,1.4 v41.91,2.67
  Top 0.305: U4.3 47.17,19.12 v47.75,18.54 | JP10.3A 42.04,0.89 42.23,1.08
  Top 0.381: J1.GND 6.04,38.04
  other vias: 5.08,49.53 64.77,39.37 40.64,17.78 27.69,50.8 43.43,20.95 49.53,25.4 35.69,25.4 2.03,5.21 29.21,44.45 67.31,22.86 17.78,19.81 17.4,15.24 66.04,25.4 6.35,33.02 13.97,29.84 12.7,33.02 12.7,26.67 10.16,35.56 10.16,45.72 17.78,39.37 23.75,13.46 35.56,15.24 39.37,19.81
  pour Top (isolate 0.305, rank 2): 0,53.34 68.58,53.34 68.58,0 0,0
  pour Bottom (isolate 0.305, rank 2): 0,53.34 68.58,53.34 68.58,0 0,0
INSERT  (via drill 0.38)
  Top 0.305: J3.P$4 5.45,2.94 v4.95,3.43 | Q1.1 4.04,27.87 R4.1 1.99,27.65 v0.89,26.54
  Bottom 0.305: v4.95,3.43 4.95,12.32 0.89,16.38 v0.89,26.54
IO2
  Top 0.305: JP11.3A 58.42,44.45 52.32,38.35 52.32,19.94 48.41,16.03 U4.32
IO3
  Top 0.305: JP11.4A 55.88,43.18 51.69,38.99 51.69,20.19 49.02,17.53 48.77,17.53 48.76,17.52 U4.1
IO4  (via drill 0.38)
  Top 0.305: v46.99,25.53 46.99,38.1 53.34,44.45 JP11.5A | U4.2 43.94,18.32 v43.69,18.07
  Bottom 0.305: v43.69,18.07 46.99,21.37 v46.99,25.53
IO5
  Top 0.305: U4.9 44.71,38.1 50.8,44.19 JP11.6A
IO6
  Top 0.254: 48.26,43.72 JP11.7A
  Top 0.305: U4.10 43.91,39.37 48.26,43.72
IO7
  Top 0.305: U4.11 43.11,40.64 45.72,43.25
  Top 0.356: 45.72,43.25 JP11.8A
IO8
  Top 0.305: U4.12 42.31,45.32 41.66,45.97 JP2.10B
IO9
  Top 0.305: U4.13 41.51,43.58 39.12,45.97 JP2.9B
LV_SCL
  Top 0.305: Q2.2 60.36,18.03 | 60.36,18.03 60.36,18.98 R11.1 | J4.4 60.38,18.01 60.36,18.03
LV_SDA
  Top 0.305: J4.3 64.51,17.01 64.77,17.27 64.77,19.81 64.26,20.32 55.75,20.32 55.03,19.6 R5.1 54.48,19.05 54.1,18.67 54.1,16.13 54.37,15.86 Q3.2
MISO  (via drill 0.38, 0.38 pad 0.51)
  Top 0.305: U4.16 39.11,25.66 v37.34,27.43 38.1,28.19 38.1,39.37 31.5,45.97 JP2.6B | J2.1 TP4.P$1
  Bottom 0.305: v37.34,27.43 39.24,29.34 58.67,29.34 59.82,30.48 TP4.P$1
  other vias: 63.5,30.48
MOSI  (via drill 0.38, 0.38 pad 0.51)
  Top 0.305: U4.15 39.91,26.13 v39.5,26.54 39.5,40.51 34.04,45.97 JP2.7B | J2.4 TP2.P$1
  Bottom 0.305: v39.5,26.54 56.9,26.54 60.96,22.48 64.9,22.48 67.31,24.89 67.31,27.43 66.8,27.94 TP2.P$1
  other vias: 66.04,27.94
N$1
  Top 0.305: R1.2 27.09,39.33 26.44,39.98 LED1.A
N$2
  Top 0.356: R2.1 57.57,34.38 56.92,35.03 LED2.A
N$3
  Top 0.305: U4.7 47.28,22.32 48.44,21.15 Y1.1
N$4
  Top 0.305: U4.8 47.5,23.12 47.94,23.55 Y1.3
N$5
  Top 0.305: R16.1 28.79,35.39 29.44,36.04 LED5.A
N$9
  Top 0.305: R12.1 28.79,31.58 29.44,32.23 D3.A
N$11
  Top 0.203: U2.8 13.82,43.81 Y2.3
  Top 0.254: Y2.3 14.37,45.7 C11.2
N$12
  Top 0.203: U2.7 12.96,42.93 13.21,43.18 15.75,43.18 16.13,42.8 Y2.1 16.09,41.98 C7.2
N$13
  Top 0.254: J1.D- 5.7,39.99 6.35,40.64 10.16,40.64 10.79,41.27 U2.6
N$14
  Top 0.254: U2.5 10.79,40.01 10.16,39.37 5.08,39.37 5.05,39.34 J1.D+
N$15
  Top 0.406: IC3.1 11.32,19.32 11.81,19.81 R15.1 R14.2
PWRIN
  Top 0.762: 8.38,10.92 13.2,6.11 D1.A
  Top 0.813: 8.38,10.92 4.32,10.92 2.03,13.21 J3.VIN0
RESET  (via drill 0.38, 0.38 pad 0.51)
  Top 0.254: C8.2 R3.1 28.79,25.82 v29.21,25.4
  Top 0.305: v42.31,18.27 U4.29 42.31,14.84 43.81,13.34 51.44,13.34 v52.07,13.97 | JP10.6B JP10.6A v33.02,22.86 31.75,22.86 v29.21,25.4 | TP6.P$1 J2.5 59.69,25.4 v55.88,21.59 | S1.4 S1.3 10.79,51.44 13.97,48.26 15.24,48.26 v24.13,39.37
  Bottom 0.305: v42.31,18.27 42.31,21.19 40.64,22.86 v33.02,22.86 | v29.21,25.4 29.21,34.29 v24.13,39.37 | v52.07,13.97 52.07,17.78 v55.88,21.59
  other vias: 63.5,25.4
RX-I  (via drill 0.38)
  Top 0.305: U4.30 43.11,15.31 44.45,13.97 48.13,13.97 53.59,19.43 53.59,36.7 63.5,46.61 JP11.1A 63.5,50.8 v62.23,50.8 | U2.2 21.72,36.2 v23.37,34.54 24.89,33.02 D3.C
  Bottom 0.305: v62.23,50.8 59.69,48.26 24.13,48.26 21.59,45.72 21.59,40.01 23.37,38.23 v23.37,34.54
SCK  (via drill 0.38, 0.38 pad 0.51)
  Top 0.305: U4.17 v37.62,24.92 36.32,26.21 36.32,27.94 36.83,28.45 36.83,38.86 | J2.3 TP5.P$1 | JP2.5B 28.96,47.24 36.83,39.37 36.83,38.86 | R1.1 36.83,38.86
  Bottom 0.305: v37.62,24.92 37.62,26.06 39.5,27.94 TP5.P$1
  other vias: 63.5,27.94
SHLD  (via drill 0.38)  (3 unrouted)
  Top 0.203: J1.SHIELD J1.SHIELD10 3.85,42.03 J1.SHIELD8 | J1.SHIELD6 3.92,36.67 J1.SHIELD11
  Top 0.508: J1.SHIELD3 1.19,41.82 J1.SHIELD8
  Bottom 0.203: J1.SHIELD12 J1.SHIELD11
  other vias: 1.27,43.94 4.19,43.94 1.27,34.8
  pour Bottom: 0,44.45 5.08,44.45 5.08,34.29 0,34.29
  pour Top: 0,44.45 5.08,44.45 5.08,34.29 0,34.29
SS
  Top 0.305: U4.14 40.71,41.84 36.58,45.97 JP2.8B
TX-O  (via drill 0.38)
  Top 0.305: U4.31 43.91,15.27 44.45,14.73 48.01,14.73 52.96,19.68 52.96,37.72 60.96,45.72 JP11.2B | U2.3 v21.72,37.47 22.23,37.47 22.86,36.83 LED5.C | v59.69,50.8 60.96,50.8 JP11.2A
  Bottom 0.305: v59.69,50.8 58.42,49.53 24.13,49.53 20.32,45.72 20.32,39.37 21.72,37.97 v21.72,37.47
USBVCC
  Top 0.508: 9.31,29.8 C15.+ F1.2 7.25,28.06 7.45,27.86 Q1.3 8,26.92 8.76,27.69 C12.1
V3
  Top 0.305: U2.4 C17.1
VCC  (via drill 0.38)
  Top 0.305: v55.88,22.86 55.88,27.94 59.27,31.33 R2.2 63.37,33.78 66.04,31.11 TP1.P$1 J2.2 | U2.16 8.51,34.92 9.31,34.12 | R3.2 26.16,27.3 v25.59,27.88 19.34,34.12 9.31,34.12 | R6.2 57.66,13.97 | 57.66,13.97 R13.2 | v57.66,15.24 57.66,13.97 | C18.1 9.31,34.12 | R12.2 v25.78,31.11 | R16.2 v25.78,34.92
  Top 0.508: U4.6 44.52,21.52 44.07,21.97 42.29,21.97 41.91,21.59 | C2.2 U4.18 39.91,22.32 v40.64,21.59 41.91,21.59 | v47.77,19.92 U4.4 42.31,19.92 41.91,20.32 41.91,21.59 | v31.75,21.59 30.48,22.86 27.94,22.86 | I/O.2 27.94,22.86 | R3.2 27.09,25.49 27.94,24.64 27.94,22.86
  Bottom 0.305: v47.77,19.92 52.94,19.92 v55.88,22.86 57.15,22.86 57.66,22.35 v57.66,15.24 | v25.78,34.92 v25.78,31.11 25.78,28.07 v25.59,27.88
  Bottom 0.508: v40.64,21.59 v31.75,21.59
  other vias: 66.04,30.48
VIN  (via drill 0.38)
  Top 0.305: JP10.1A JP10.1B
  Top 0.762: v29.2,7.1 25.9,7.1 24.76,8.24 C5.+ 17.16,8.24 16,9.4 D1.C 16,21.59 13.72,23.88 IC3.3
  Top 0.813: v41.9,7.1 44.59,7.1 45.72,5.97 JP10.1B
  Bottom 0.813: v29.2,7.1 v41.9,7.1
VUSB  (via drill 0.38)
  Top 0.381: J1.VBUS 5.08,40.64
  Top 0.508: 5.08,40.64 v5.97,41.53 | F1.1 C10.1 3.43,29.88 v3.43,31.11
  Bottom 0.508: v3.43,31.11 3.43,33.02 3.94,33.53 5.21,33.53 5.71,34.04 5.71,41.27 v5.97,41.53

### Text on the board
Bottom: v23
Measures: Units in inches
tDocu: J. Lindblom, N. Seidle | Based on Arduino by: M. Banzi, D. Cuartielles, / T. Igoe, G. Martino, D. Mellis
214bmp: D:/SmartProjects/Snc/a4_bn_logo2.bmp